# Altium schematic sheet PSU_DAQ_MCU.SchDoc
size A4
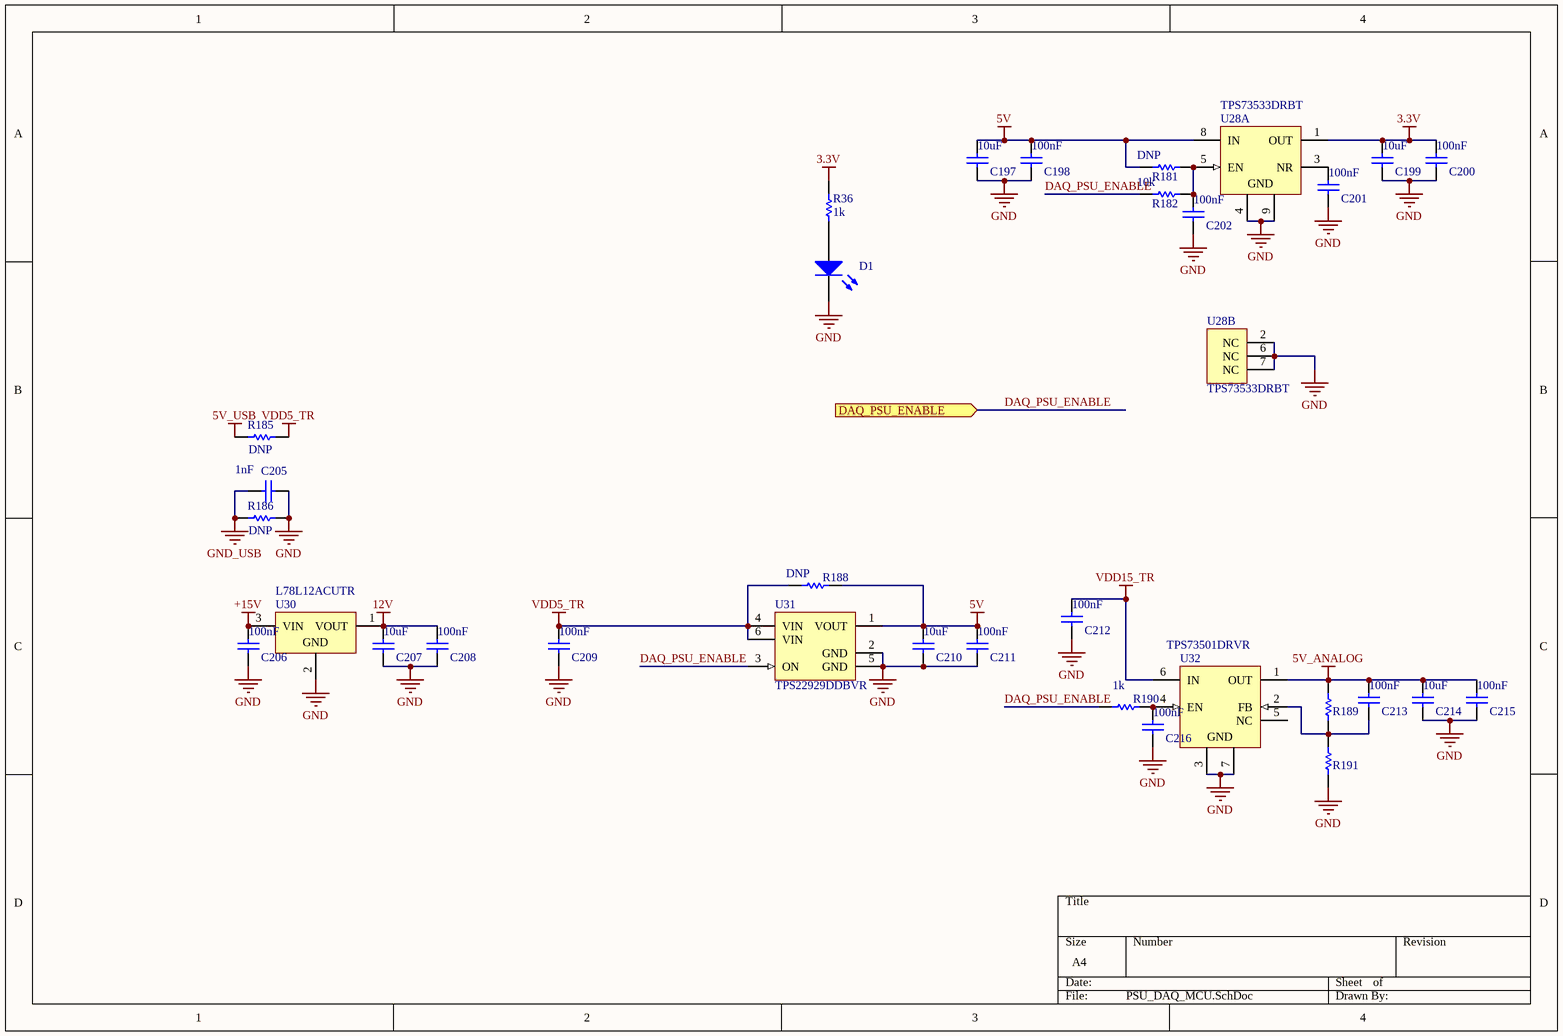
[diagram p0: PSU_DAQ_MCU.SchDoc]

## Parts
C197  value 10uF  [CAPC0805(2012)145_L]  (hidden comment: CAP0805)
C198  value 100nF  [CAPC0402(1005)60_L]  (hidden comment: CAP0402)
C199  value 10uF  [CAPC0805(2012)145_L]  (hidden comment: CAP0805)
C200  value 100nF  [CAPC0402(1005)60_L]  (hidden comment: CAP0402)
C201  value 100nF  [CAPC0402(1005)60_L]  (hidden comment: CAP0402)
C202  value 100nF  [CAPC0402(1005)60_L]  (hidden comment: CAP0402)
C205  value 1nF  [CAPC1808(4520)175_L]  (hidden comment: CAP1808)
C206  value 100nF  [CAPC0402(1005)60_L]  (hidden comment: CAP0402)
C207  value 10uF  [CAPC0805(2012)145_L]  (hidden comment: CAP0805)
C208  value 100nF  [CAPC0402(1005)60_L]  (hidden comment: CAP0402)
C209  value 100nF  [CAPC0402(1005)60_L]  (hidden comment: CAP0402)
C210  value 10uF  [CAPC0805(2012)145_L]  (hidden comment: CAP0805)
C211  value 100nF  [CAPC0402(1005)60_L]  (hidden comment: CAP0402)
C212  value 100nF  [CAPC0402(1005)60_L]  (hidden comment: CAP0402)
C213  value 100nF  [CAPC0402(1005)60_L]  (hidden comment: CAP0402)
C214  value 10uF  [CAPC0805(2012)145_L]  (hidden comment: CAP0805)
C215  value 100nF  [CAPC0402(1005)60_L]  (hidden comment: CAP0402)
C216  value 100nF  [CAPC0402(1005)60_L]  (hidden comment: CAP0402)
D1  Green_LED_150060GS75000  [Green_LED_150060GS75000]  (value not drawn)
R36  value 1k  [RESC0402(1005)_L]  (hidden comment: RES0402)
R181  value DNP  [RESC0402(1005)_L]  (hidden comment: RES0402)
R182  value 10k  [RESC0402(1005)_L]  (hidden comment: RES0402)
R185  value DNP  [RESC2010(5025)_L]  (hidden comment: RES2010)
R186  value DNP  [RESC2010(5025)_L]  (hidden comment: RES2010)
R188  value DNP  [RESC0402(1005)_L]  (hidden comment: RES0402)
R189  RES0402  [RESC0402(1005)_L]  (value not drawn)
R190  value 1k  [RESC0402(1005)_L]  (hidden comment: RES0402)
R191  RES0402  [RESC0402(1005)_L]  (value not drawn)
U28  TPS73533DRBT  [DRB0008A_V]  (parts A,B of 2)
U30  L78L12ACUTR  [SOT-89_N]
U31  TPS22929DDBVR  [DBV6_N]
U32  TPS73501DRVR  [TI-DRV6-1600X1000TP_V]

## Ports
DAQ_PSU_ENABLE (in)

## Nets
3.3V: C199.2 C200.1 R36.1 U28.1(OUT)
5V: C197.2 C198.1 C210.2 C211.1 R181.1 R188.1 U28.8(IN) U31.1(VOUT)
5V_ANALOG: C213.1 C214.2 C215.1 R189.1 U32.1(OUT)
5V_USB: R185.1
12V: C207.2 C208.1 U30.1(VOUT)
+15V: C206.1 U30.3(VIN)
GND: C197.1 C198.2 C199.1 C200.2 C201.2 C202.2 C205.2 C206.2 C207.1 C208.2 C209.2 C210.1 C211.2 C212.2 C214.1 C215.2 C216.2 D1.1 R186.2 R191.2 U28.2(NC) U28.4(GND) U28.6(NC) U28.7(NC) U28.9(GND) U30.2(GND) U31.2(GND) U31.5(GND) U32.3(GND) U32.7(GND)
GND_USB: C205.1 R186.1
VDD5_TR: C209.1 R185.2 R188.2 U31.4(VIN) U31.6(VIN)
VDD15_TR: C212.1 U32.6(IN)
DAQ_PSU_ENABLE: R182.1 R190.2 U31.3(ON) ; port DAQ_PSU_ENABLE
NetC201_1: C201.1 U28.3(NR)
NetC202_1: C202.1 R181.2 R182.2 U28.5(EN)
NetC213_2: C213.2 R189.2 R191.1 U32.2(FB)
NetC216_1: C216.1 R190.1 U32.4(EN)
NetD1_2: D1.2 R36.2

Not connected (* = marked no-connect by the designer): U32 5(NC)

## Library data of the parts
C197 C199 C207 C210 C214 = CMP-1590-00003-1: 0805 (2012 Metric) Chip Capacitor; Case-EIA: 0805; Case-Metric: 2012; PackageReference: CAPC0805(2012)145
C198 C200-C202 C206 C208 C209 C211-C213 C215 C216 = CMP-1590-00004-1: 0402 (1005 Metric) Chip Capacitor; Case-EIA: 0402; Case-Metric: 1005; PackageReference: CAPC0402(1005)60
C205 = CMP-1590-00006-1: 1808 (4520 Metric) Chip Capacitor; Case-Metric: 4520; Case-EIA: 1808; PackageReference: CAPC1808(4520)175
D1 = Green_LED_150060GS75000: WURTH ELEKTRONIK  150060GS75000  LED, Green, SMD, 30 mA, 3.2 V, 520 nm; Unit Cost: 0.287; ComponentLinkURL1: http://ie.farnell.com/wurth-elektronik/150060gs75000/led-0603-green-430mcd-520nm/dp/2322070?ost=150060GS75000&selectedCategoryId=&categoryNameResp=All%2BCategories&searchView=table&iscrfnonsku=false; Manufacturer Part Number: 150060GS75000; Supplier 1: Farnell; Supplier Part Number 1: 2322070; Manufacturer: WURTH ELEKTRONIK
R36 R181 R182 R188-R191 = CMP-1591-00004-1: 0402 (1005 Metric) Chip Resistor; Case-EIA: 0402; Case-Metric: 1005; PackageReference: RESC0402(1005)
R185 R186 = CMP-1591-00006-1: 2010 (5025 Metric) Chip Resistor; Case-Metric: 5025; Case-EIA: 2010; PackageReference: RESC2010(5025)
U28 = CMP-0395-00583-2: Single Output High PSRR LDO, 500 mA, Fixed 3.3 V Output, 2.7 to 6.5 V Input, with Low IQ, 8-pin SON (DRB), -40 to 125 degC, Green (RoHS & no Sb/Br); Manufacturer: Texas Instruments; SubFamily: Single Channel LDO; Vout Adj(Min)(V): 3.3; Iq(Typ)(mA): 0.04; Vdo(Typ)(mV): 280; Vin(Min)(V): 2.7; Vin(Max)(V): 6.5; Accuracy(%): 2; Iout(Max)(A): 0.5; ComponentLink3Description: Package Specification; ComponentLink2Description: Datasheet; DatasheetVersion: SBVS087J; ComponentLink1Description: Manufacturer URL; PartNumber: TPS73533DRBT; ComponentLink2URL: http://www.ti.com/general/docs/lit/getliterature.tsp?genericPartNumber=TPS73533&fileType=pdf; ComponentLink3URL: http://www.ti.com/litv/pdf/mpds118h; Fixed Output Options(V): 3.3; Eco-Plan: Green (RoHS & no Sb/Br); ComponentLink1URL: http://www.ti.com/; PackageDescription: 8-Pin Plastic Small Outline, Body 3 x 3 mm, Pitch 0.65 mm; Mounting Technology: Surface Mount; PackageVersion: 4203482-2/K; Vout Adj(Max)(V): 3.3; PackageReference: DRB0008A
U30 = CMP-0244-00387-1: Positive Voltage Regulator, 12V, 4-Pin SOT-89, Tape and Reel; DatasheetVersion: 1/02/2011; PackageDescription: 3-Pin SOT-89 Package 1.5 mm Pitch, 4.1 mm Lead Span; ComponentLink2Description: Datasheet; ComponentLink1Description: Manufacturer URL; PackageVersion: 2011; PackageReference: SOT-89; ComponentLink1URL: http://www.st.com; ComponentLink2URL: http://www.st.com/internet/com/TECHNICAL_RESOURCES/TECHNICAL_LITERATURE/DATASHEET/CD00000446.pdf
U31 = CMP-0330-00011-1: Low Input Voltage, 1.8 A Single Channel Load Switch with Controlled Turn-On, 1.8 V Logic Compatible, 1.8 A, 1.4 to 5.5 V, -40 to 85 degC, 6-pin SOT-23 (DBV), Green (RoHS & no Sb/Br); Manufacturer: Texas Instruments; Quick Output Discharge Transistor: Yes; SubFamily: Non Current Limited Load Switch; Iin(nA): 10000; Control Logic: 1.8-V Logic Compatible; HBM ESD(kV): 2; Vin(V): 1.4 - 5.5; Active High Enable: TRUE; Output Rise Time(ÂµS): 4500; Imax(A): 1.8; rON @1.8V(mOhm): 85; PartNumber: TPS22929DDBVR; Eco-Plan: Green (RoHS & no Sb/Br); ComponentLink1Description: Datasheet; DatasheetVersion: SLVSB39; PackageReference: DBV6; PackageVersion: revK, Mar-2006; PackageDescription: 6-Pin Plastic Small-Outline Package, 2.9 x 1.6 mm Body, 0.95 mm Pitch, 2.8 mm Lead Span; ComponentLink1URL: http://www.ti.com/general/docs/lit/getliterature.tsp?genericPartNumber=TPS22929D&fileType=pdf; Code_JEDEC: MO-178-AB*; Mounting Technology: Surface Mount
U32 = CMP-0395-00669-1: Single Output High PSRR LDO, 500 mA, Adjustable 1.25 to 6 V Output, 2.7 to 6.5 V Input, with Low IQ, 6-pin SON (DRV), -40 to 125 degC, Green (RoHS & no Sb/Br); Manufacturer: Texas Instruments; SubFamily: Single Channel LDO; Vin(Max)(V): 6.5; Vin(Min)(V): 2.7; Vout Adj(Min)(V): 1.25; Vdo(Typ)(mV): 280; Accuracy(%): 2; Iout(Max)(A): 0.5; Iq(Typ)(mA): 0.04; Vout Adj(Max)(V): 6; ComponentLink1Description: Manufacturer URL; ComponentLink2URL: http://www.ti.com/general/docs/lit/getliterature.tsp?genericPartNumber=TPS73501&fileType=pdf; PackageReference: DRV6-1600X1000TP; ComponentLink2Description: Datasheet; Mounting Technology: Surface Mount; PackageVersion: 4206925/E; DatasheetVersion: SBVS087J; Eco-Plan: Green (RoHS & no Sb/Br); ComponentLink1URL: http://www.ti.com/; PartNumber: TPS73501DRVR; ComponentLink3URL: http://www.ti.com/litv/pdf/mpds216d; PackageDescription: 6-Pin Plastic Small Outline No-Lead, Body 2 x 2 mm, Pitch 0.65 mm; ComponentLink3Description: Package Specification